# Altium schematic sheet Motor - Motor Control.SchDoc: [7] Motor - Motor Control
size A4; ApprovedBy: Nagy Richard; CheckedBy: Nagy Richard; Author: Nagy Richard; CompanyName: EmbedCore; DrawnBy: Nagy Richard; Engineer: Nagy Richard; Organization: EmbedCore; DocumentNumber: 7; Revision: 1.0; SheetNumber: 7; SheetTotal: 15
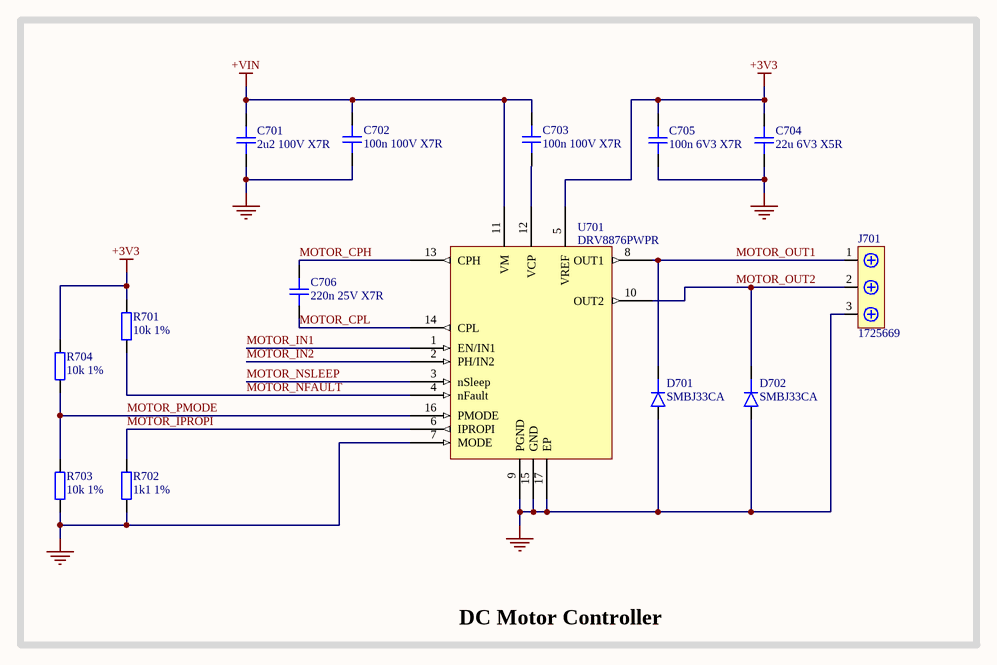
[diagram p0: Motor - Motor Control.SchDoc]

## Parts
C701  2u2 100V X7R  [CAP_0805]
C702  100n 100V X7R  [CAP_0603]
C703  100n 100V X7R  [CAP_0603]
C704  22u 6V3 X5R  [CAP_0603]
C705  100n 6V3 X7R  [CAP_0402]
C706  220n 25V X7R  [CAP_0603]
D701  SMBJ33CA  [DO-214AC-2 (SMA)]
D702  SMBJ33CA  [DO-214AC-2 (SMA)]
J701  1725669  [1725669]
R701  10k 1%  [RES_0402]
R702  1k1 1%  [RES_0402]
R703  10k 1%  [RES_0402]
R704  10k 1%  [RES_0402]
U701  DRV8876PWPR  [SOP65P640X120-16N]

## Blocks framed on the sheet
DC Motor Controller: C701-C706 D701 D702 J701 R701-R704 U701

## Nets
+3V3: C704.2 C705.2 R701.2 R704.2 U701.5(VREF)
+VIN: C701.2 C702.2 C703.2 U701.11(VM)
GND: C701.1 C702.1 C704.1 C705.1 D701.A D702.A J701.3 R702.1 R703.1 U701.7(MODE) U701.9(PGND) U701.15(GND) U701.17(EP)
MOTOR_CPH: C706.2 U701.13(CPH)
MOTOR_CPL: C706.1 U701.14(CPL)
MOTOR_IN1: U701.1(EN/IN1)
MOTOR_IN2: U701.2(PH/IN2)
MOTOR_IPROPI: R702.2 U701.6(IPROPI)
MOTOR_NFAULT: R701.1 U701.4(nFault)
MOTOR_NSLEEP: U701.3(nSleep)
MOTOR_OUT1: D701.K J701.1 U701.8(OUT1)
MOTOR_OUT2: D702.K J701.2 U701.10(OUT2)
MOTOR_PMODE: R703.2 R704.1 U701.16(PMODE)
NetC703_1: C703.1 U701.12(VCP)

## Notes on the sheet
- Title:
- Drawn By:
- Page Contents:
- Checked By:
- Size:
- Date:
- File:
- License:
- Email:
- A4
- Number:
- Time:
- Revision:
- Sheet
- Website:
- of

## Library data of the parts
C701 = CAP_0805: Capacitor SMD 0805; Manufacturer: *; Manufacturer Part Number: *; Distributor Link: *; LCSC: *; Rating: *; Dielectric: *
C702 C703 = CAP_0603: Capacitor SMD 0603; Manufacturer: *; Manufacturer Part Number: *; Distributor Link: *; LCSC: *; Rating: *; Dielectric: *
C704 C706 = CAP_0603: Capacitor SMD 0603; Manufacturer: Samsung Electro-Mechanics; Manufacturer Part Number: CL10A226MQ8NRNC; Distributor Link: www.lcsc.com; Rating: *; Dielectric: *
  C704: LCSC: C59461
  C706: LCSC: C21120
C705 = CAP_0402: Capacitor SMD 0402; Manufacturer: YAGEO; Manufacturer Part Number: CC0402KRX7R5BB104; Distributor Link: www.lcsc.com; LCSC: C541406; Rating: *; Dielectric: *
D701 D702 = D_SMA: Diode SMD SMA (DO-214AA); Manufacturer: Littelfuse; Manufacturer Part Number: SMBJ33CA
J701 = 1725669: Screw Terminal Block 3 Positions 2.54mm; Manufacturer: Phoenix; Manufacturer Part Number: 1725669; Distributor Link: https://www.mouser.de/ProductDetail/Phoenix-Contact/1725669?qs=A%2FKWGUWTCZjmkTL0Oe91ew%3D%3D
R701-R704 = RES_0402: Resistor SMD 0402; Manufacturer: PANASONIC; Manufacturer Part Number: ERJPA2F1002X; Distributor Link: www.lcsc.com
  R701 R703 R704: LCSC: C427247
  R702: LCSC: C409028
U701 = DRV8876PWPR: DRV8876 H-Bridge Motor Driver With Integrated Current Sense and Regulation; Manufacturer: Texas Instruments; LCSC: C575551